# EAGLE design TestBench_rev3.6 (EAGLE 6.4)
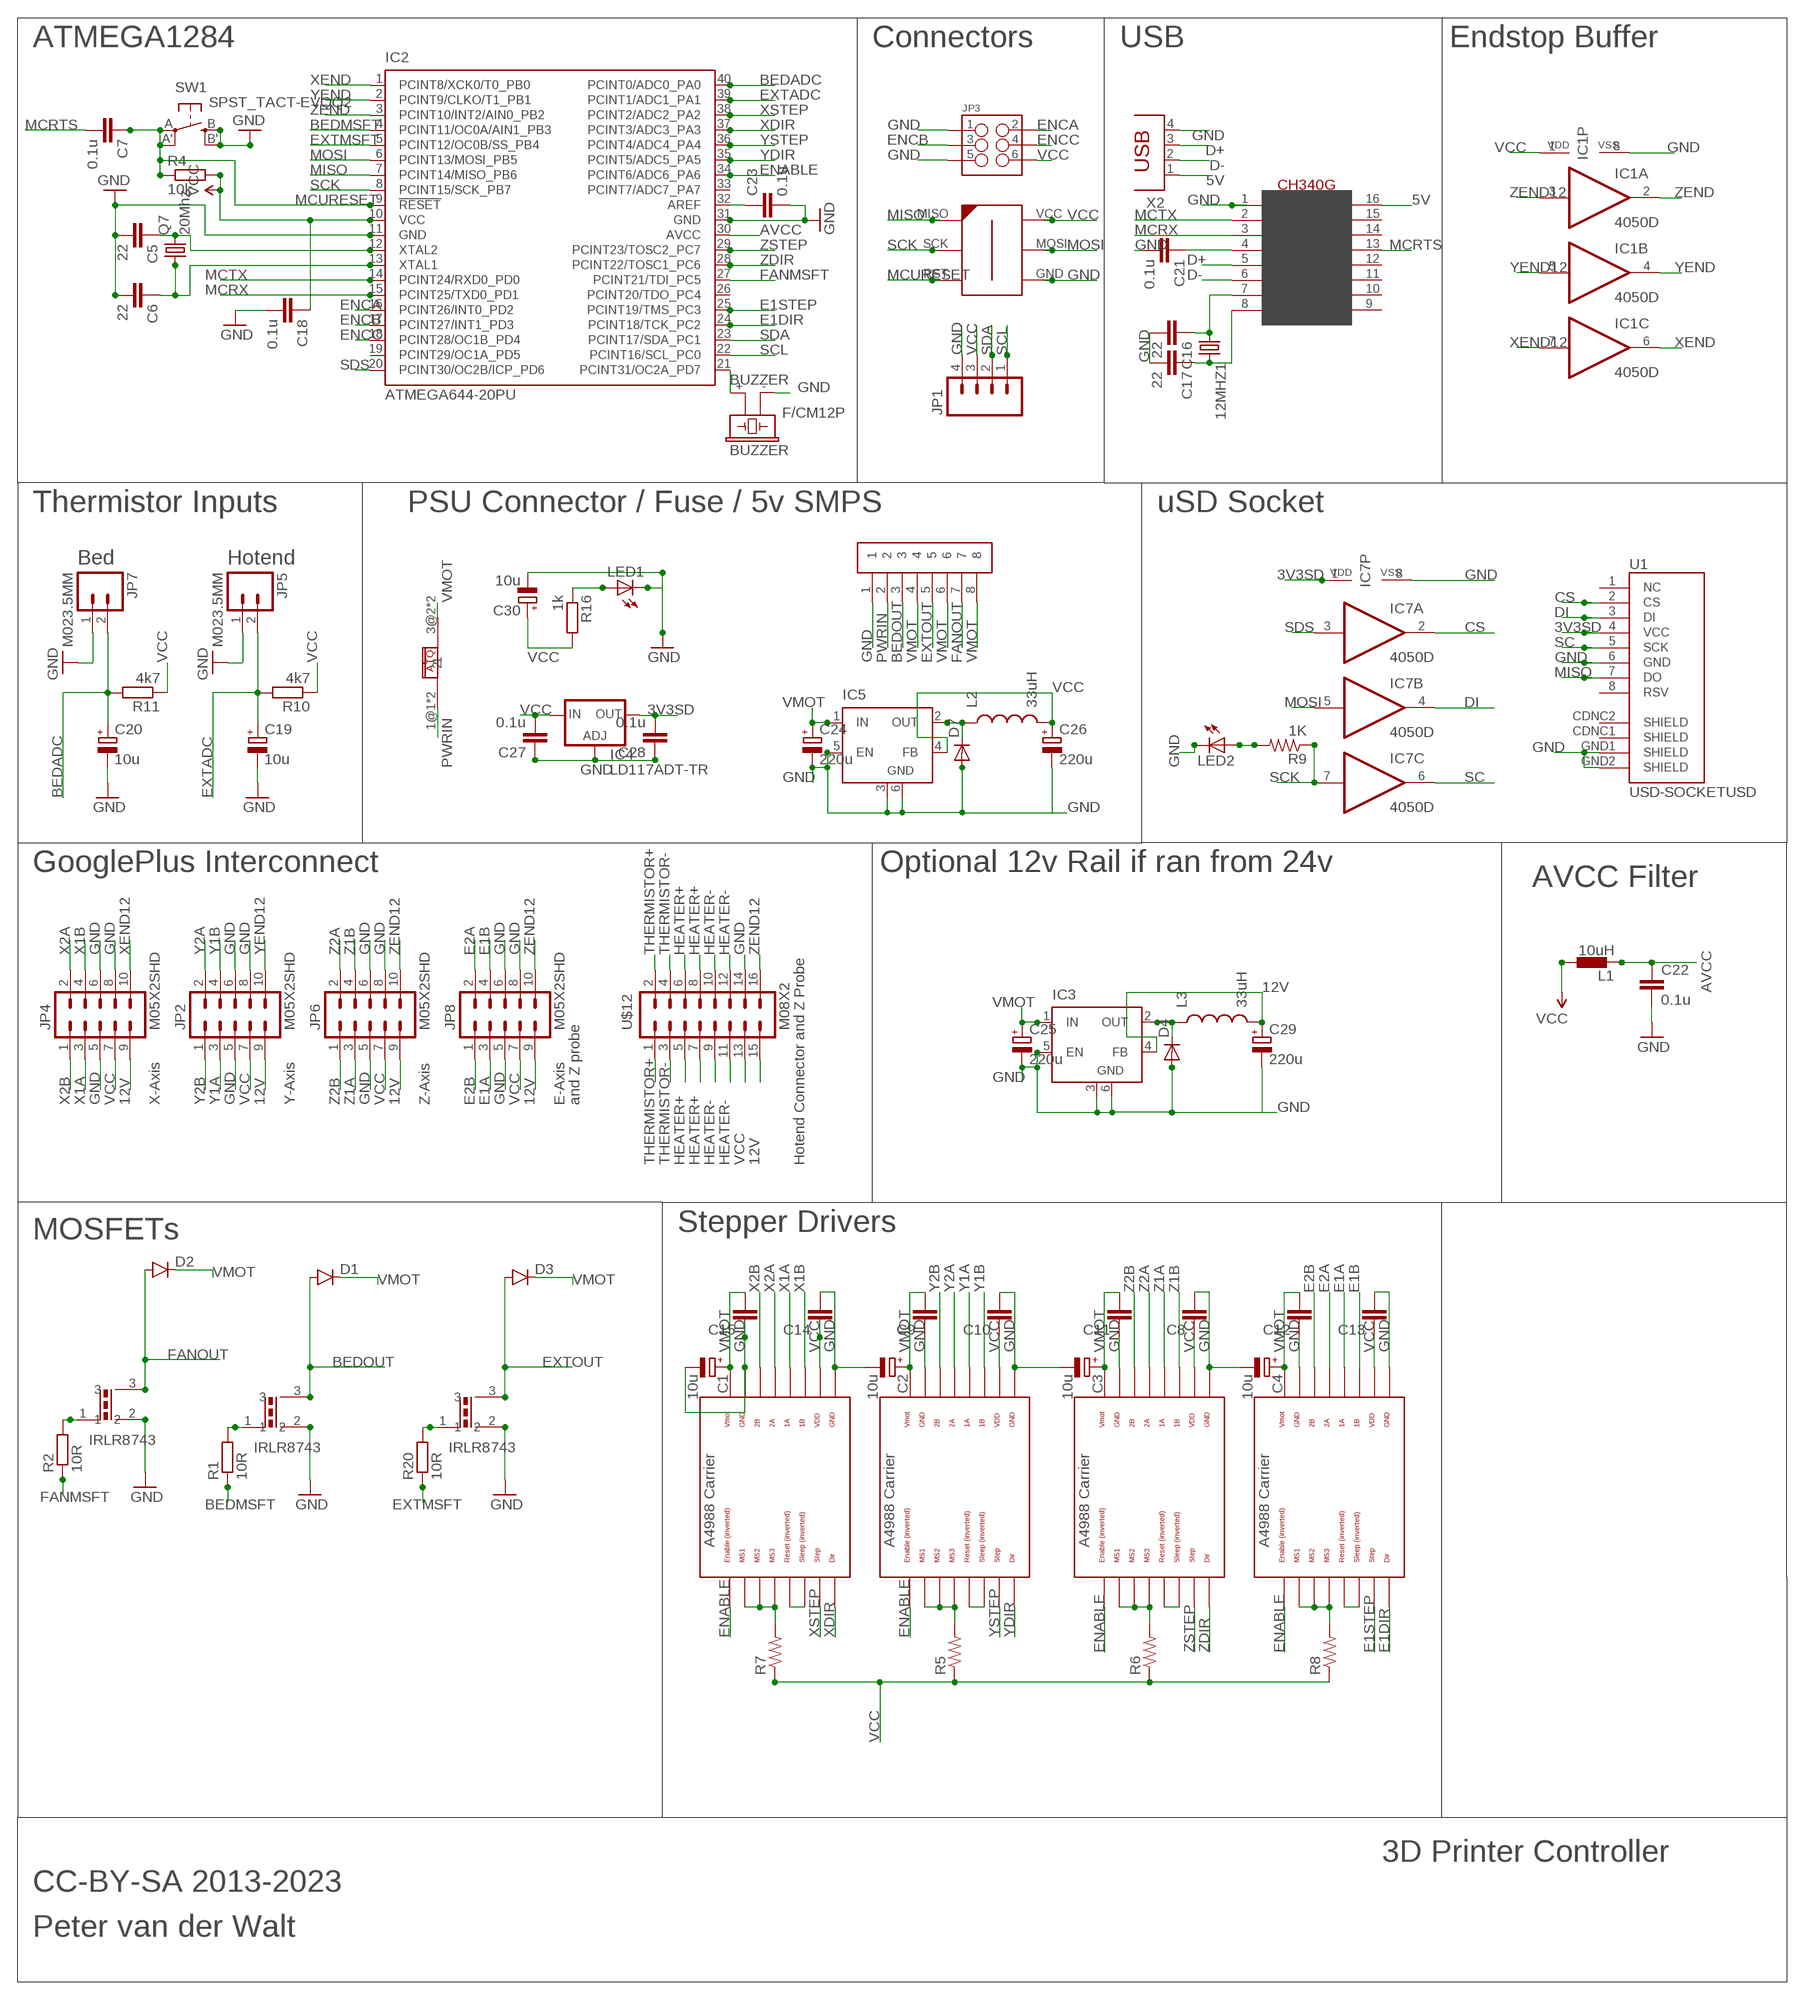
[diagram p0: schematic, sheet 1]

## Parts
12MHZ1  CRYSTALHC49UP  [HC49UP]
BUZZER  F/CM12P  [F/CM12P]
C1  10u  CPOL-EUSANYO_SMD_B6  [SANYO-OSCON_SMD_B6]
C2  10u  CPOL-EUSANYO_SMD_B6  [SANYO-OSCON_SMD_B6]
C3  10u  CPOL-EUSANYO_SMD_B6  [SANYO-OSCON_SMD_B6]
C4  10u  CPOL-EUSANYO_SMD_B6  [SANYO-OSCON_SMD_B6]
C5  22  CAP1206  [1206]
C6  22  CAP1206  [1206]
C7  0.1u  CAP1206  [1206]
C8  CAP1206  [1206]
C9  CAP1206  [1206]
C10  CAP1206  [1206]
C11  CAP1206  [1206]
C12  CAP1206  [1206]
C13  CAP1206  [1206]
C14  CAP1206  [1206]
C15  CAP1206  [1206]
C16  22  CAP1206  [1206]
C17  22  CAP1206  [1206]
C18  0.1u  CAP1206  [1206]
C19  10u  CPOL-EUSANYO_SMD_B6  [SANYO-OSCON_SMD_B6]
C20  10u  CPOL-EUSANYO_SMD_B6  [SANYO-OSCON_SMD_B6]
C21  0.1u  CAP1206  [1206]
C22  0.1u  CAP1206  [1206]
C23  0.1u  CAP1206  [1206]
C24  220u  CPOL-EU153CLV-0605  [153CLV-0605]
C25  220u  CPOL-EU153CLV-0605  [153CLV-0605]
C26  220u  CPOL-EU153CLV-0605  [153CLV-0605]
C27  0.1u  CAP1206  [1206]
C28  0.1u  CAP1206  [1206]
C29  220u  CPOL-EU153CLV-0605  [153CLV-0605]
C30  10u  CPOL-EUSANYO_SMD_B6  [SANYO-OSCON_SMD_B6]
D1  DIODESMA-ALT  [SMA-DIODE_ALT]
D2  DIODESMA-ALT  [SMA-DIODE_ALT]
D3  DIODESMA-ALT  [SMA-DIODE_ALT]
D4  DIODE-DO-214AC  [DO-214AC]
D7  DIODE-DO-214AC  [DO-214AC]
E1POL  POLOLU_A4983CARRIER  [A4988BREAKOUT]
IC1  4050D  [SO16]
IC2  ATMEGA644-20PU  [DIL40]
IC3  LM2596S  [TO263-5]
IC4  LD117ADT-TR  [DPACK]
IC5  LM2596S  [TO263-5]
IC7  4050D  [SO16]
JP1  M04LOCK  [1X04_LOCK]
JP2  M05X2SHD  [2X5-SHROUDED]
JP3  M03X2SHROUD  [2X3-SHROUDED]
JP4  M05X2SHD  [2X5-SHROUDED]
JP5  M023.5MM  [SCREWTERMINAL-3.5MM-2]
JP6  M05X2SHD  [2X5-SHROUDED]
JP7  M023.5MM  [SCREWTERMINAL-3.5MM-2]
JP8  M05X2SHD  [2X5-SHROUDED]
L1  10uH  BL01RN1A  [BL01RN1A]
L2  33uH  INDUCTORPWR  [CDRH125]
L3  33uH  INDUCTORPWR  [CDRH125]
LED1  LEDSMT1206  [1206]
LED2  LEDSMT1206  [1206]
Q7  20Mhz  CRYSTALHC49UP  [HC49UP]
R1  10R  R-EU_M1206  [M1206]
R2  10R  R-EU_M1206  [M1206]
R4  10k  R-EU_M1206  [M1206]
R5  RESISTOR1206  [1206]
R6  RESISTOR1206  [1206]
R7  RESISTOR1206  [1206]
R8  RESISTOR1206  [1206]
R9  1K  R-US_M1206  [M1206]
R10  4k7  R-EU_M1206  [M1206]
R11  4k7  R-EU_M1206  [M1206]
R16  1k  R-EU_M1206  [M1206]
R20  10R  R-EU_M1206  [M1206]
SW1  SPST_TACT-EVQQ2  [EVQ-Q2]
U1  USD-SOCKETUSD  [USD-SOCKET-PP]
U$1  IRLR8743  [TO263]
U$2  CH340G  [SOIC16]
U$3  IRLR8743  [TO263]
U$4  IRLR8743  [TO263]
U$5  XY825A-8P  [XY825A-8P]
U$6  CQ-121  [CQ121]
U$7  AVR-ISP-6-EDGE  [6PAD_ISP]
U$12  M08X2  [2X8]
X2  PN61729  [PN61729]
XPOL  POLOLU_A4983CARRIER  [A4988BREAKOUT]
YPOL  POLOLU_A4983CARRIER  [A4988BREAKOUT]
ZPOL  POLOLU_A4983CARRIER  [A4988BREAKOUT]

## Nets
3V3SD: C28.2 IC4.4(OUT) IC7.1(P:VDD) U1.4(VCC)
5V: U$2.16(VCC) X2.1
12V: C29.+ IC3.4(FB) JP2.9 JP4.9 JP6.9 JP8.9 L3.2 U$12.15
AVCC: C22.1 IC2.30(AVCC) L1.1
BEDADC: C20.+ IC2.40(PCINT0/ADC0_PA0) JP7.2 R11.2
BEDMSFT: IC2.4(PCINT11/OC0A/AIN1_PB3) R1.1
BEDOUT: D1.A U$3.3 U$5.3
BUZZER: BUZZER.+ IC2.21(PCINT31/OC2A_PD7)
CS: IC7.2(A:O) U1.2(CS)
D+: U$2.5(D+) X2.3
D-: U$2.6(D-) X2.2
DI: IC7.4(B:O) U1.3(DI)
E1A: E1POL.1A JP8.3
E1B: E1POL.1B JP8.4
E1DIR: E1POL.DIR IC2.24(PCINT18/TCK_PC2)
E1STEP: E1POL.STEP IC2.25(PCINT19/TMS_PC3)
E2A: E1POL.2A JP8.2
E2B: E1POL.2B JP8.1
ENABLE: E1POL.EN IC2.34(PCINT6/ADC6_PA6) XPOL.EN YPOL.EN ZPOL.EN
ENCA: IC2.16(PCINT26/INT0_PD2) JP3.2
ENCB: IC2.17(PCINT27/INT1_PD3) JP3.3
ENCC: IC2.18(PCINT28/OC1B_PD4) JP3.4
EXTADC: C19.+ IC2.39(PCINT1/ADC1_PA1) JP5.2 R10.2
EXTMSFT: IC2.5(PCINT12/OC0B/SS_PB4) R20.1
EXTOUT: D3.A U$1.3 U$5.5
FANMSFT: IC2.27(PCINT21/TDI_PC5) R2.1
FANOUT: D2.A U$4.3 U$5.7
GND: BUZZER.- C1.- C2.- C3.- C4.- C5.2 C6.2 C8.2 C9.1 C10.2 C11.1 C12.1 C13.2 C14.2 C15.1 C16.2 C17.2 C18.2 C19.- C20.- C21.2 C22.2 C23.2 C24.- C25.- C26.- C27.1 C28.1 C29.- C30.- D4.2(A) D7.2(A) E1POL.GND E1POL.GND@0(GND) IC1.8(P:VSS) IC2.11(GND) IC2.31(GND) IC3.3(GND) IC3.5(EN) IC3.6(GND) IC4.1(ADJ) IC5.3(GND) IC5.5(EN) IC5.6(GND) IC7.8(P:VSS) JP1.4 JP2.5 JP2.6 JP2.8 JP3.1 JP3.5 JP4.5 JP4.6 JP4.8 JP5.1 JP6.5 JP6.6 JP6.8 JP7.1 JP8.5 JP8.6 JP8.8 LED1.C LED2.C SW1.B'(S1) SW1.B(S) U1.6(GND) U1.GND1(SHIELD) U1.GND2(SHIELD) U$1.2 U$2.1(GND) U$3.2 U$4.2 U$5.1 U$7.GND U$12.14 X2.4 XPOL.GND XPOL.GND@0(GND) YPOL.GND YPOL.GND@0(GND) ZPOL.GND ZPOL.GND@0(GND)
HEATER+: U$12.5 U$12.6 U$12.7 U$12.8
HEATER-: U$12.9 U$12.10 U$12.11 U$12.12
MCRTS: C7.2 U$2.13(DTR)
MCRX: IC2.15(PCINT25/TXD0_PD1) U$2.3(RX)
MCTX: IC2.14(PCINT24/RXD0_PD0) U$2.2(TX)
MCURESET: C7.1 IC2.9(!RESET) R4.1 SW1.A'(P1) SW1.A(P) U$7.RST
MISO: IC2.7(PCINT14/MISO_PB6) U1.7(DO) U$7.MISO
MOSI: IC2.6(PCINT13/MOSI_PB5) IC7.5(B:I) U$7.MOSI
N$1: D4.1(C) IC3.2(OUT) L3.1
N$7: R1.2 U$3.1
N$8: R2.2 U$4.1
N$9: D7.1(C) IC5.2(OUT) L2.1
N$11: C5.1 IC2.12(XTAL2) Q7.2
N$12: C6.1 IC2.13(XTAL1) Q7.1
N$14: E1POL.RST E1POL.SLP(SLEEP)
N$15: ZPOL.RST ZPOL.SLP(SLEEP)
N$16: YPOL.RST YPOL.SLP(SLEEP)
N$17: XPOL.RST XPOL.SLP(SLEEP)
N$18: R7.2 XPOL.MS1 XPOL.MS2 XPOL.MS3
N$19: R5.2 YPOL.MS1 YPOL.MS2 YPOL.MS3
N$20: E1POL.MS1 E1POL.MS2 E1POL.MS3 R8.2
N$21: R6.2 ZPOL.MS1 ZPOL.MS2 ZPOL.MS3
N$38: 12MHZ1.1 C16.1 U$2.7(XI)
N$39: LED2.A R9.2
N$40: 12MHZ1.2 C17.1 U$2.8(XO)
N$41: C21.1 U$2.4(V3)
N$46: R20.2 U$1.1
N$54: C23.1 IC2.32(AREF)
N$64: LED1.A R16.1
PWRIN: U$5.2 U$6.1@1 U$6.2@1
SC: IC7.6(C:O) U1.5(SCK)
SCK: IC2.8(PCINT15/SCK_PB7) IC7.7(C:I) R9.1 U$7.SCK
SCL: IC2.22(PCINT16/SCL_PC0) JP1.1
SDA: IC2.23(PCINT17/SDA_PC1) JP1.2
SDS: IC2.20(PCINT30/OC2B/ICP_PD6) IC7.3(A:I)
THERMISTOR+: U$12.1 U$12.2
THERMISTOR-: U$12.3 U$12.4
VCC: C8.1 C10.1 C13.1 C14.1 C18.1 C26.+ C27.2 C30.+ E1POL.VDD IC1.1(P:VDD) IC2.10(VCC) IC4.3(IN) IC5.4(FB) JP1.3 JP2.7 JP3.6 JP4.7 JP6.7 JP8.7 L1.2 L2.2 R4.2 R5.1 R6.1 R7.1 R8.1 R10.1 R11.1 R16.2 U$7.VCC U$12.13 XPOL.VDD YPOL.VDD ZPOL.VDD
VMOT: C1.+ C2.+ C3.+ C4.+ C9.2 C11.2 C12.2 C15.2 C24.+ C25.+ D1.C D2.C D3.C E1POL.VMOT IC3.1(IN) IC5.1(IN) U$5.4 U$5.6 U$5.8 U$6.3@2 U$6.4@2 XPOL.VMOT YPOL.VMOT ZPOL.VMOT
X1A: JP4.3 XPOL.1A
X1B: JP4.4 XPOL.1B
X2A: JP4.2 XPOL.2A
X2B: JP4.1 XPOL.2B
XDIR: IC2.37(PCINT3/ADC3_PA3) XPOL.DIR
XEND: IC1.6(C:O) IC2.1(PCINT8/XCK0/T0_PB0)
XEND12: IC1.7(C:I) JP4.10
XSTEP: IC2.38(PCINT2/ADC2_PA2) XPOL.STEP
Y1A: JP2.3 YPOL.1A
Y1B: JP2.4 YPOL.1B
Y2A: JP2.2 YPOL.2A
Y2B: JP2.1 YPOL.2B
YDIR: IC2.35(PCINT5/ADC5_PA5) YPOL.DIR
YEND: IC1.4(B:O) IC2.2(PCINT9/CLKO/T1_PB1)
YEND12: IC1.5(B:I) JP2.10
YSTEP: IC2.36(PCINT4/ADC4_PA4) YPOL.STEP
Z1A: JP6.3 ZPOL.1A
Z1B: JP6.4 ZPOL.1B
Z2A: JP6.2 ZPOL.2A
Z2B: JP6.1 ZPOL.2B
ZDIR: IC2.28(PCINT22/TOSC1_PC6) ZPOL.DIR
ZEND: IC1.2(A:O) IC2.3(PCINT10/INT2/AIN0_PB2)
ZEND12: IC1.3(A:I) JP6.10 JP8.10 U$12.16
ZSTEP: IC2.29(PCINT23/TOSC2_PC7) ZPOL.STEP
Unconnected: IC1.9(D:I) IC1.10(D:O) IC1.11(E:I) IC1.12(E:O) IC1.14(F:I) IC1.15(F:O) IC2.19(PCINT29/OC1A_PD5) IC2.26(PCINT20/TDO_PC4) IC2.33(PCINT7/ADC7_PA7) IC7.9(D:I) IC7.10(D:O) IC7.11(E:I) IC7.12(E:O) IC7.14(F:I) IC7.15(F:O) U1.1(NC) U1.8(RSV) U1.CDNC1(SHIELD) U1.CDNC2(SHIELD) U$2.9(CTS) U$2.10(DSR) U$2.11(RI) U$2.12(DCD) U$2.14(RTS) U$2.15(RS232)

## Notes on the sheet
- ATMEGA1284 | Connectors | USB | Endstop Buffer
- Thermistor Inputs | PSU Connector / Fuse / 5v SMPS | uSD Socket
- Bed | Hotend
- GooglePlus Interconnect | Optional 12v Rail if ran from 24v
- AVCC Filter
- X-Axis | Y-Axis | Z-Axis | E-Axis | and Z probe
- Hotend Connector and Z Probe
- MOSFETs | Stepper Drivers
- 3D Printer Controller
- CC-BY-SA 2013-2023
- Peter van der Walt

## Library data of the parts
12MHZ1 = crystal:CRYSTAL: CRYSTAL; OC_FARNELL: unknown; OC_NEWARK: unknown
BUZZER = buzzer:F/CM12P: BUZZER Source: Buerklin; OC_FARNELL: unknown; OC_NEWARK: unknown
C1-C4 C19 C20 C24-C26 C29 C30 = rcl:CPOL-EU: POLARIZED CAPACITOR, European symbol
C5-C18 C21-C23 C27 C28 = SparkFun-Passives:CAP: Capacitor Standard 0603 ceramic capacitor, and 0.1" leaded capacitor.
D1-D3 = SparkFun-DiscreteSemi:DIODE: Diode These are standard reverse protection diodes and small signal diodes. SMA package can handle up to about 1A. SOD-323 can handle about 200mA. What the SOD-323 package when ordering, there are some mfgs out there that are 5-pin packages.
D4 D7 = dp_devices:DIODE: Various Diode Packages
E1POL XPOL YPOL ZPOL = RepRapjr:POLOLU_A4983CARRIER
IC1 IC7 = 40xx:4050: Hex non-inverting BUFFER
IC2 = atmel:ATMEGA644-*PU: 8-bit Microcontroller with 64K Bytes In-System Programmable Flash Auto generated by make-symbol-device-package-bsdl.ulp Rev. 34 Source: http://www.atmel.com/dyn/resources/prod_documents/doc2593.pdf; MPN: ATMEGA644-20PU; OC_FARNELL: 1288340; OC_NEWARK: 23M5060
IC3 IC5 = linear:LM2596S: STEP-DOWN VOLTAGE REGULATOR
IC4 = v-reg:LD117A?*: Low drop fixed and adjustable positive voltage regulators 1 A Source: http://www.st.com/stonline/products/literature/ds/7194/ld1117axx.pdf
JP1 = SparkFun-Connectors:M04: Header 4 Standard 4-pin 0.1" header. Use with straight break away headers (SKU : PRT-00116), right angle break away headers (PRT-00553), swiss pins (PRT-00743), machine pins (PRT-00117), and female headers (PRT-00115). Molex polarized connector foot print use with SKU : PRT-08231 with associated crimp pins and housings. 1MM SMD Version SKU: PRT-10208
JP2 JP4 JP6 JP8 = SparkFun-Connectors:M05X2: Header 5x2 Standard 10-pin dual row 0.1" header. Commonly used with AVR-ISP. Use with Spark Fun Electronics SKU: PRT-00778
JP3 = SparkFun-Connectors:M03X2: 2x3 .1" header. Shrouded, with keying- CONN-10681 SMT- CONN-11415 Pogo pins- HW-11044; PROD_ID: CONN-10681
JP5 JP7 = SparkFun-Connectors:M02: Standard 2-pin 0.1" header. Use with - straight break away headers ( PRT-00116) - right angle break away headers (PRT-00553) - swiss pins (PRT-00743) - machine pins (PRT-00117) - female headers (PRT-00115) Molex polarized connector foot print use with: PRT-08233 with associated crimp pins and housings. 2.54_SCREWTERM for use with PRT-10571. 3.5mm Screw Terminal footprints for PRT-08084 5mm Screw Terminal footprints for use with PRT-08432
L1 = inductors:BL0: Noise Suppression Products/EMI Suppression Filters, Lead EMIFIL(R) Inductor Type Source: http://www.murata.com .. BL01RN1_DS.pdf
L2 L3 = SparkFun-Passives:INDUCTOR: Inductors Basic Inductor/Choke - 0603 and 1206. Footprints are not proven and vary greatly between part numbers. SRN6045- 33uH, 20% 1.4A SDR0403-560KL - 56uH, 10%, 500mA RMS/740mA peak
LED1 LED2 = adafruit:LED: LED OSRAM: - CHIPLED LG R971, LG N971, LY N971, LG Q971, LY Q971, LO R971, LY R971 LH N974, LH R974 LS Q976, LO Q976, LY Q976 LO Q996 - Hyper CHIPLED LW Q18S LB Q993, LB Q99A, LB R99A - SideLED LS A670, LO A670, LY A670, LG A670, LP A670 LB A673, LV A673, LT A673, LW A673 LH A674 LY A675 LS A676, LA A676, LO A676, LY A676, LW A676 LS A679, LY A679, LG A679 - Hyper Micro SIDELED® LS Y876, LA Y876, LO Y876, LY Y876 LT Y87S - SmartLED LW L88C, LW L88S LB L89C, LB L89S, LG L890 LS L89K, LO L89K, LY L89K LS L896, LA L896, LO L896, LY L896 - TOPLED LS T670, LO T670, LY T670, LG T670, LP T670 LSG T670, LSP T670, LSY T670, LOP T670, LYG T670 LG T671, LOG T671, LSG T671 LB T673, LV T673, LT T673, LW T673 LH T674 LS T676, LA T676, LO T676, LY T676, LB T676, LH T676, LSB T676, LW T676 LB T67C, LV T67C, LT T67C, LS T67K, LO T67K, LY T67K, LW E67C LS E67B, LA E67B, LO E67B, LY E67B, LB E67C, LV E67C, LT E67C LW T67C LS T679, LY T679, LG T679 LS T770, LO T770, LY T770, LG T770, LP T770 LB T773, LV T773, LT T773, LW T773 LH T774 LS E675, LA E675, LY E675, LS T675 LS T776, LA T776, LO T776, LY T776, LB T776 LHGB T686 LT T68C, LB T68C - Hyper Mini TOPLED® LB M676 - Mini TOPLED Santana® LG M470 LS M47K, LO M47K, LY M47K Source: http://www.osram.convergy.de/
Q7 = adafruit:CRYSTAL: CRYSTAL; OC_FARNELL: unknown; OC_NEWARK: unknown
R1 R2 R4 R10 R11 R16 R20 = resistor:R-EU_: RESISTOR, European symbol
R5-R8 = SparkFun-Passives:RESISTOR: Resistor Basic schematic elements and footprints for 0603, 1206, and PTH resistors.
R9 = adafruit:R-US_: RESISTOR, American symbol
SW1 = adafruit:SPST_TACT: SMT 6mm switch, EVQQ2 series http://www.ladyada.net/library/eagle
U1 = SparkFun-Connectors_PETERMICROSDEBAY:USD-SOCKET: microSD Socket Push-push type uSD socket. Schematic element and footprint production proven. Spark Fun Electronics SKU : PRT-00127. tDoc lines correctly indicate media card edge positions when inserting (unlocked, locked, depressed).
U$1 U$3 U$4 = IRLR8743:IRLR8743
U$2 = usb-serial:CH340G
U$5 = Communica.co.za:XY825A-8P
U$6 = Mantech.co.za:CQ-121
U$7 = atmega-atxmega:AVR-ISP-6-EDGE: 6 pin edge connector for ISP with ATMEL MCUs. Developed by Craig Moates (craig at moates dot net). Library by David Blundell (blundar at gmail dot com). Often, even a 6 pin header is really inconvenient for board layout and/or production. This SMD-only header is our de-facto standard for using an edge connector for programming with the help of a 6pin/10pin to edge card adapter.
U$12 = SparkFun-Connectors:M08X2: .1" headers, two rows of 8 each
X2 = con-berg:PN61729: BERG USB connector; OC_FARNELL: unknown; OC_NEWARK: unknown

## Board
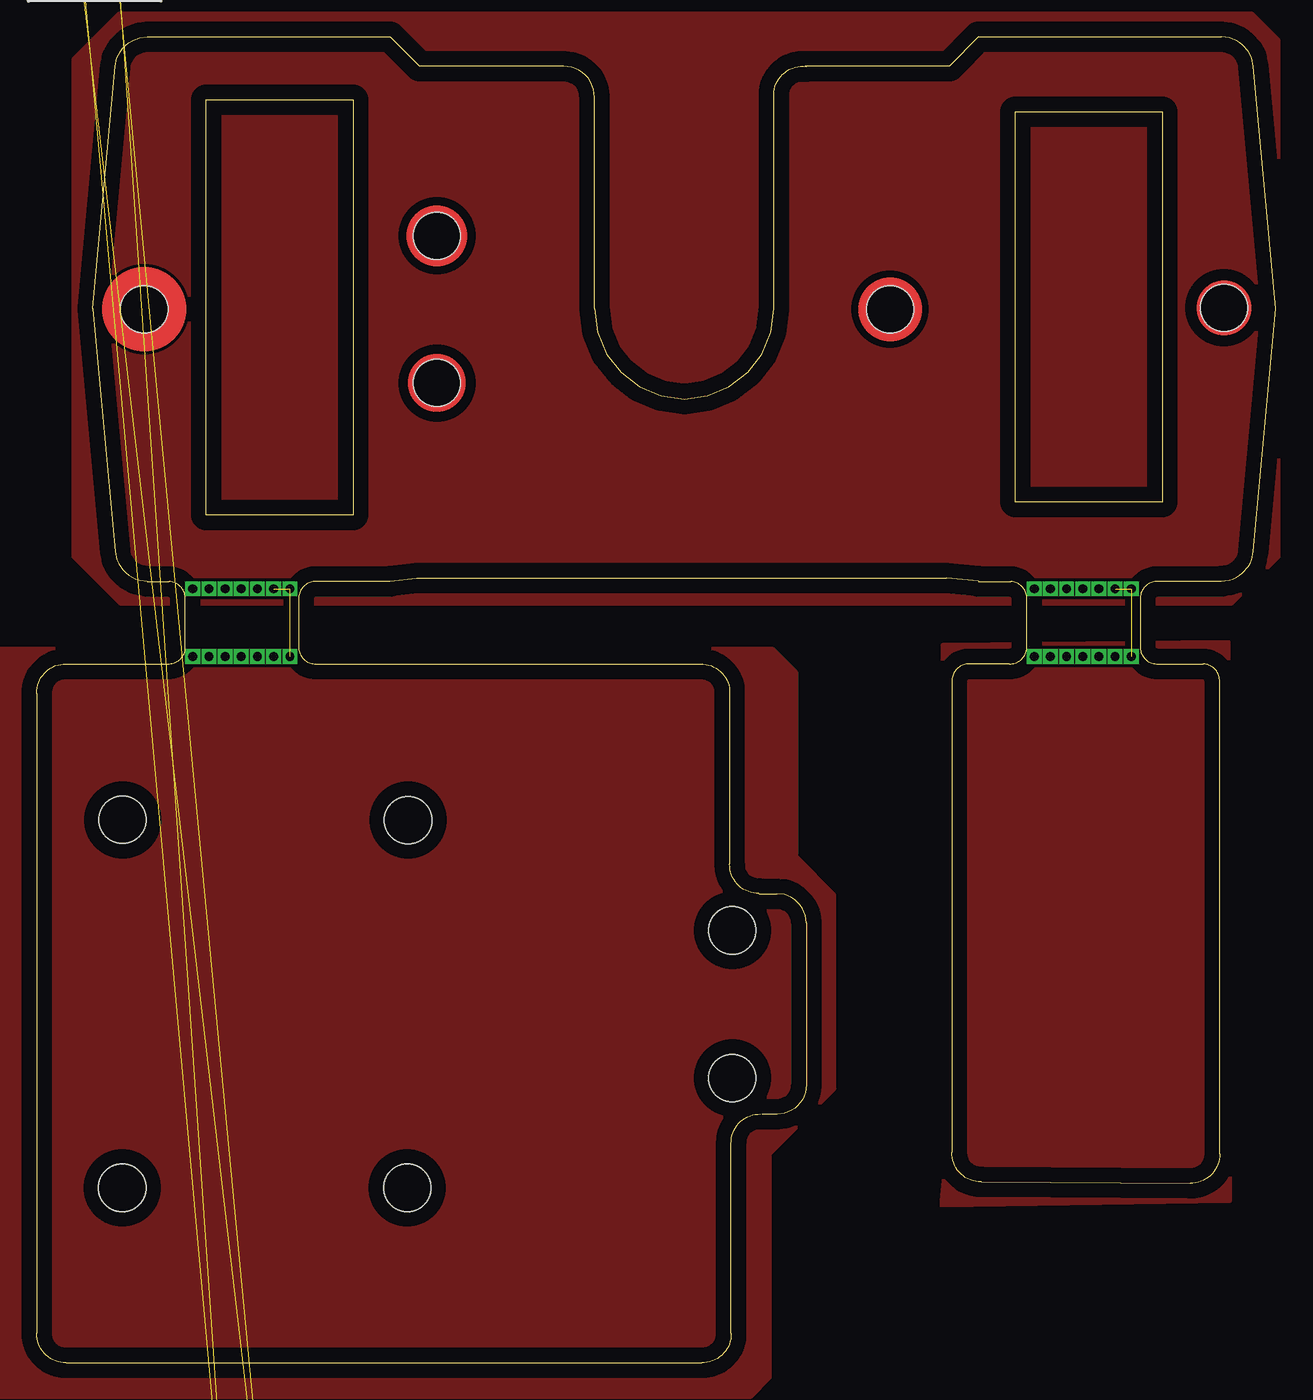
[diagram p1: board, top side]
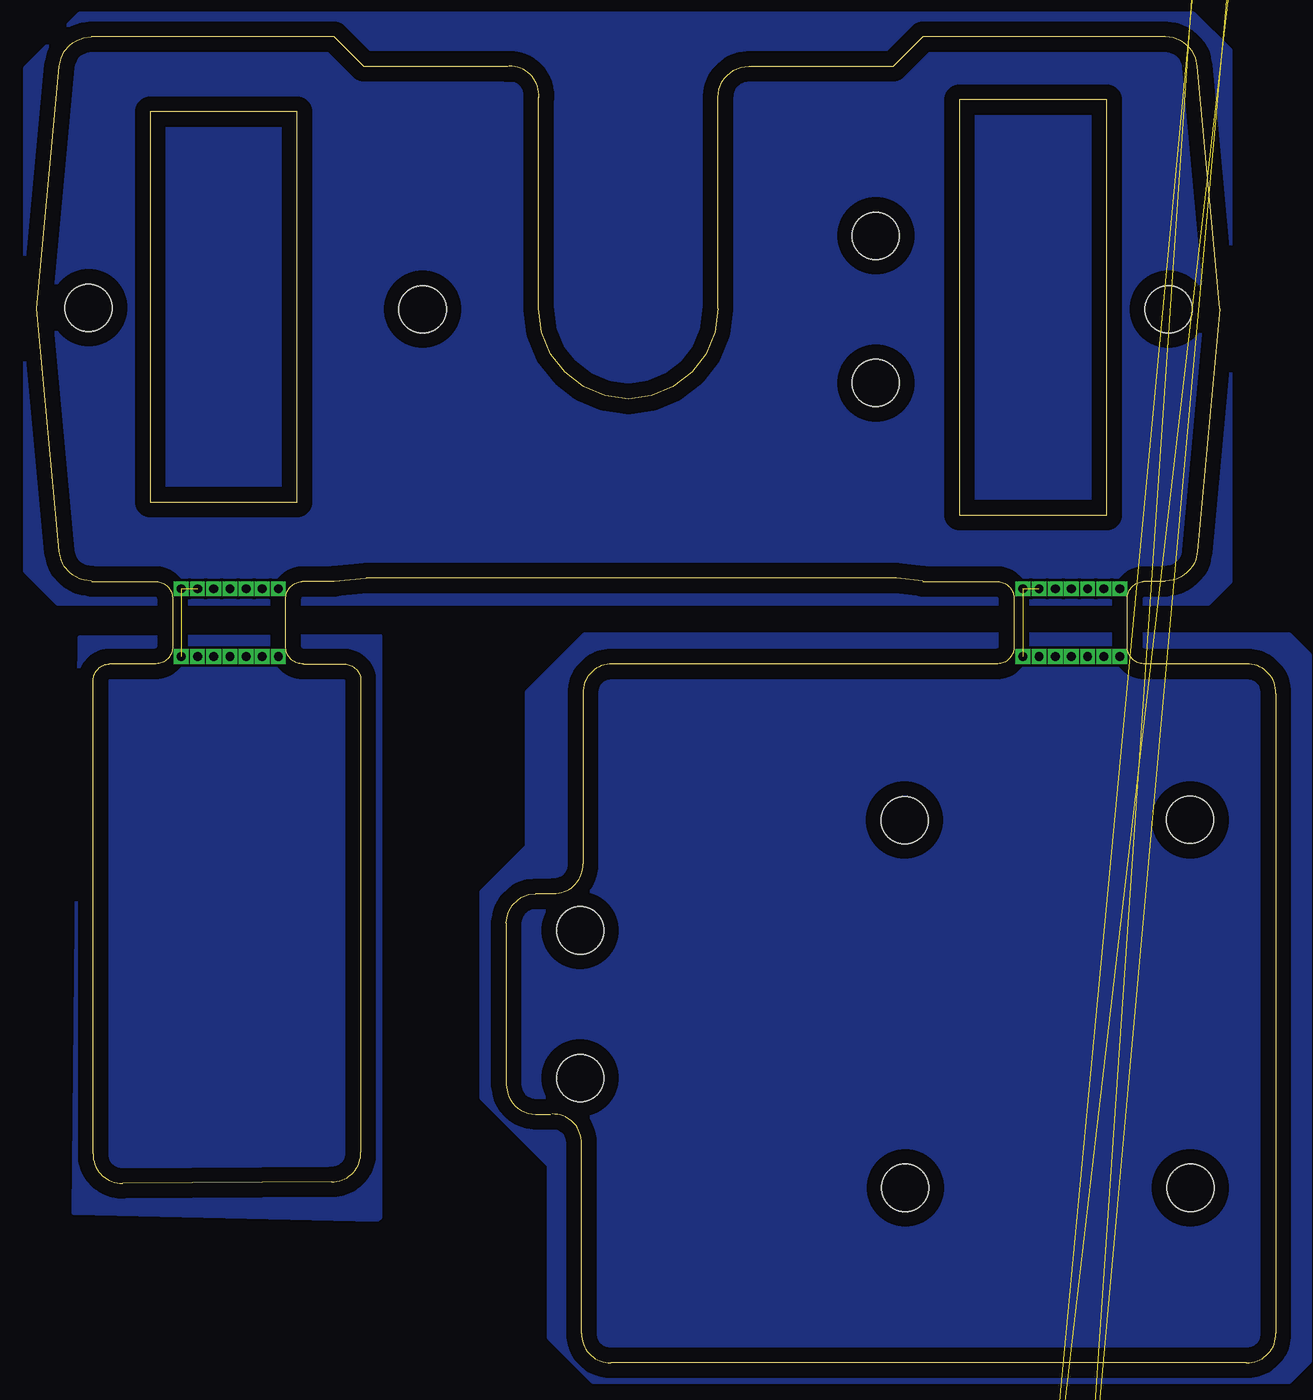
[diagram p2: board, bottom side, seen from below]

Size 84.23 x 90.13 mm. Coordinates in mm from the lower left corner, seen from the top.
Outline: 49.09,31.87 50.31,31.87 50.81,31.82 51.07,31.72 51.3,31.62 51.53,31.47 51.88,31.11 52.03,30.88 52.16,30.66 52.24,30.4 52.31,29.89 52.31,18.9 52.24,18.36 52.16,18.11 52.03,17.88 51.88,17.68 51.7,17.47 51.53,17.3 51.3,17.14 51.07,17.04 50.81,16.97 50.31,16.89 49.29,16.89
Outline: 80.52,53.12 81.05,53.19 81.3,53.27 81.56,53.4 81.79,53.52 81.99,53.7 82.35,54.11 82.47,54.34 82.57,54.59 82.7,55.12 84.23,71.63 82.7,88.12 82.57,88.65 82.47,88.91 82.35,89.13 81.99,89.54 81.79,89.72 81.56,89.85 81.3,89.97 81.05,90.05 80.52,90.13 64.01,90.13 62.03,88.12 52.22,88.12
Outline: 64.01,53.12 61.83,53.32 25.81,53.32 24,53.12
Outline: 7.52,53.12 6.98,53.19 6.73,53.27 6.48,53.4 6.25,53.52 6.05,53.7 5.84,53.91 5.69,54.11 5.56,54.34 5.44,54.59 5.33,55.12 3.81,71.63 5.33,88.12 5.44,88.65 5.56,88.91 5.69,89.13 5.84,89.34 6.05,89.54 6.25,89.72 6.48,89.85 6.73,89.97 6.98,90.05 7.52,90.13 24,90.13 26.01,88.12 35.81,88.12 36.35,88.04 36.63,87.97 36.85,87.84 37.08,87.69 37.29,87.51 37.49,87.31 37.64,87.08 37.84,86.57 37.92,86.01 37.92,71.63 38.12,70.03 38.73,68.56 39.7,67.32 40.97,66.35 42.44,65.74 44.02,65.51 45.59,65.74 47.07,66.35 48.34,67.32 49.3,68.56 49.91,70.03 50.11,71.63 50.11,86.01
Outline: 49.2,16.9 arc93 47.2,14.9 47.2,2 arc-93 45.2,0 2,0 arc-93 0,2 0,45.5 arc-93 2,47.5 8.9,47.5 arc90 10.1,48.6 10.1,51.9 arc90 9,53.1 7.5,53.1
Outline: 49.1,31.9 arc-93 47.1,33.9 47.1,45.5 arc93 45.1,47.5 18.9,47.5 arc-90 17.8,48.7 17.8,52 arc-90 19,53.1 24,53.1
Outline: 50.1,86 arc-102 52.3,88.1
Outline: 64,53.1 66.2,53.1 arc-90 67.3,51.9 67.3,48.6 arc-90 66.1,47.5 63.4,47.5 arc90 62.2,46.4 62.2,14.3 arc93 64.2,12.3 78.4,12.2 arc93 80.4,14.2 80.4,46.3 arc90 79.3,47.5 76.1,47.5 arc-90 75,48.7 75,52 arc-90 76.2,53.1 80.5,53.1
Outline: 21.51,57.61 11.51,57.61 11.51,85.83 21.51,85.83 21.51,57.61
Outline: 66.52,58.51 66.52,85.03 76.5,85.03 76.5,58.51 66.52,58.51
Copper layers (1*16): Top 0.035mm / dielectric 1.5mm / Bottom 0.035mm
Design rules "default": minimum track width 10mil, minimum drill 24mil, track to track 8mil, track to pad 8mil, pad to pad 8mil, via to via 8mil, smd to smd 8mil, copper to edge 40mil, drill to drill 8mil, minimum pad ring 10mil, minimum via ring 8mil, stop-mask expansion 4mil, vias tented up to drill 0mil, thermal gap 10mil
Holes 3.2 mm at 5.83,36.9 25.24,36.88 25.19,11.89 5.81,11.89 47.28,29.39 47.28,19.35 80.7,71.7 58,71.6 27.2,66.6 27.2,76.6 7.3,71.6

### Footprints (pad centres in the part's own frame; a part is rotated, then mirrored left to right if it is on the bottom)
HC49UP = smd 5.334 x 1.93: 1 -4.826,0; 2 4.826,0
F/CM12P = drill 1.016 pad 2.54 octagon: + 3.81,0; - -3.81,0
SANYO-OSCON_SMD_B6 = smd 3 x 1.6: + 2.2,0; - -2.2,0
1206 = smd 1.6 x 1.8: 1 -1.4,0; 2 1.4,0
153CLV-0605 = smd 3.5 x 1.6: + 2.7,0; - -2.7,0
SMA-DIODE_ALT = smd 2 x 2: A -2,0; C 2,0
DO-214AC = smd 1.27 x 2.1: 1 -1.98,0; 2 1.98,0
A4988BREAKOUT = drill 0.9 pad 1.676: 1A 8.89,1.27; 1B 11.43,1.27; 2A 6.35,1.27; 2B 3.81,1.27; DIR 16.51,-11.43; EN -1.27,-11.43; GND 16.51,1.27; GND@0 1.27,1.27; MS1 1.27,-11.43; MS2 3.81,-11.43; MS3 6.35,-11.43; RST 8.89,-11.43; SLP 11.43,-11.43; STEP 13.97,-11.43; VDD 13.97,1.27; VMOT -1.27,1.27
SO16 = smd 0.66 x 2.032: 1 -4.445,-3.073; 2 -3.175,-3.073; 3 -1.905,-3.073; 4 -0.635,-3.073; 5 0.635,-3.073; 6 1.905,-3.073; 7 3.175,-3.073; 8 4.445,-3.073; 9 4.445,3.073; 10 3.175,3.073; 11 1.905,3.073; 12 0.635,3.073; 13 -0.635,3.073; 14 -1.905,3.073; 15 -3.175,3.073; 16 -4.445,3.073
DIL40 = drill 0.813 long: 1 -24.13,-7.62; 2 -21.59,-7.62; 3 -19.05,-7.62; 4 -16.51,-7.62; 5 -13.97,-7.62; 6 -11.43,-7.62; 7 -8.89,-7.62; 8 -6.35,-7.62; 9 -3.81,-7.62; 10 -1.27,-7.62; 11 1.27,-7.62; 12 3.81,-7.62; 13 6.35,-7.62; 14 8.89,-7.62; 15 11.43,-7.62; 16 13.97,-7.62; 17 16.51,-7.62; 18 19.05,-7.62; 19 21.59,-7.62; 20 24.13,-7.62; 21 24.13,7.62; 22 21.59,7.62; 23 19.05,7.62; 24 16.51,7.62; 25 13.97,7.62; 26 11.43,7.62; 27 8.89,7.62; 28 6.35,7.62; 29 3.81,7.62; 30 1.27,7.62; 31 -1.27,7.62; 32 -3.81,7.62; 33 -6.35,7.62; 34 -8.89,7.62; 35 -11.43,7.62; 36 -13.97,7.62; 37 -16.51,7.62; 38 -19.05,7.62; 39 -21.59,7.62; 40 -24.13,7.62
TO263-5 = smd 1.067 x 2.159: 1 -3.404,-5.791; 2 -1.702,-5.791; 3 0,-5.791; 4 1.702,-5.791; 5 3.404,-5.791 | smd 10.8 x 10.41: 6 0,2.54
DPACK = smd 1.6 x 3: 1 -2.28,-4.8; 3 2.28,-4.8 | smd 5.8 x 6.2: 4 0,2.38
1X04_LOCK = drill 1.016 pad 1.88 square: 1 0,0.127 | drill 1.016 pad 1.88: 2 2.54,-0.127; 3 5.08,0.127; 4 7.62,-0.127
2X5-SHROUDED = drill 1.016 pad 1.88 octagon: 1 -1.27,5.08; 2 1.27,5.08; 3 -1.27,2.54; 4 1.27,2.54; 5 -1.27,0; 6 1.27,0; 7 -1.27,-2.54; 8 1.27,-2.54; 9 -1.27,-5.08; 10 1.27,-5.08
2X3-SHROUDED = drill 1.016 pad 1.88 octagon: 1 -1.27,2.54; 2 1.27,2.54; 3 -1.27,0; 4 1.27,0; 5 -1.27,-2.54; 6 1.27,-2.54
SCREWTERMINAL-3.5MM-2 = drill 1.2 pad 2.032 square: 1 0,0 | drill 1.2 pad 2.032: 2 3.5,0
BL01RN1A = drill 0.9 pad 1.5: 1 -5.08,0; 2 5.08,0
CDRH125 = smd 5.4 x 4: 1 0,4.9; 2 0,-4.9
1206' = smd 1.6 x 1.803: A -1.422,0; C 1.422,0
M1206 = smd 1.6 x 2: 1 -1.4,0; 2 1.4,0
EVQ-Q2 = smd 3.2 x 1.2: A -3.4,-2; A' 3.4,-2; B -3.4,2; B' 3.4,2
USD-SOCKET-PP = smd 0.75 x 1.5: 1 2.925,1.125; 2 1.825,1.125; 3 0.725,1.125; 4 -0.375,1.125; 5 -1.475,1.125; 6 -2.575,1.125; 7 -3.675,1.125; 8 -4.775,1.125; CD1 5.325,1.125; CD2 4.225,1.125 | smd 1.4 x 1: CDNC1 -4.55,-7.65 | smd 1.3 x 1: CDNC2 4.775,-7.65 | smd 1.5 x 1.35: GND1 -7.075,-7.55; GND2 7.075,-7.5 | hole 1.6: -5,-2.6; 5,-2.6
TO263 = smd 1.762 x 3.4: 1 -2.54,-6.6; 2 2.54,-6.6 | smd 9.34 x 9.6: 3 0,3.5
SOIC16 = smd 0.635 x 1.524: 1 -4.445,-2.695; 2 -3.175,-2.695; 3 -1.905,-2.695; 4 -0.635,-2.695; 5 0.635,-2.695; 6 1.905,-2.695; 7 3.175,-2.695; 8 4.445,-2.695; 9 4.445,2.695; 10 3.175,2.695; 11 1.905,2.695; 12 0.635,2.695; 13 -0.635,2.695; 14 -1.905,2.695; 15 -3.175,2.695; 16 -4.445,2.695
XY825A-8P = drill 1.3 pad 3.81 long: 1 -26.67,0; 2 -19.05,0; 3 -11.43,0; 4 -3.81,0; 5 3.81,0; 6 11.43,0; 7 19.05,0; 8 26.67,0
CQ121 = drill 2.5: 1@1 -7,0; 2@1 -2,0; 3@2 2,0; 4@2 7,0
6PAD_ISP = smd 1.524 x 3.302 bottom: GND 2.54,0; MOSI 0,0; VCC -2.54,0 | smd 1.524 x 3.302: MISO -2.54,0; RST 2.54,0; SCK 0,0
2X8 = drill 1.016 pad 1.88 octagon: 1 0,0; 2 0,2.54; 3 2.54,0; 4 2.54,2.54; 5 5.08,0; 6 5.08,2.54; 7 7.62,0; 8 7.62,2.54; 9 10.16,0; 10 10.16,2.54; 11 12.7,0; 12 12.7,2.54; 13 15.24,0; 14 15.24,2.54; 15 17.78,0; 16 17.78,2.54
PN61729 = drill 0.95 octagon: 1 1.25,4.71; 2 -1.25,4.71; 3 -1.25,2.71; 4 1.25,2.71 | hole 2.3: -6.02,0; 6.02,0

### Placement (x,y rotation side)
12MHZ1  42.98,435.73 180 top  (outside the outline)
BUZZER  146.17,350.95 180 top  (outside the outline)
C1  34.72,335.4 180 top  (outside the outline)
C2  34.72,360.16 180 top  (outside the outline)
C3  34.72,318.89 180 top  (outside the outline)
C4  34.72,302.38 180 top  (outside the outline)
C5  133.29,341.32 90 top  (outside the outline)
C6  133.29,347.99 270 top  (outside the outline)
C7  47.74,418.26 180 top  (outside the outline)
C8  46.16,340.48 0 top  (outside the outline)
C9  33.45,323.97 180 top  (outside the outline)
C10  46.16,323.97 0 top  (outside the outline)
C11  33.45,340.48 180 top  (outside the outline)
C12  33.45,365.24 180 top  (outside the outline)
C13  46.16,365.24 0 top  (outside the outline)
C14  46.16,307.46 0 top  (outside the outline)
C15  33.45,307.46 180 top  (outside the outline)
C16  54.73,435.41 180 top  (outside the outline)
C17  32.18,435.73 0 top  (outside the outline)
C18  228.72,310.95 0 top  (outside the outline)
C19  34.41,376.67 270 top  (outside the outline)
C20  291.44,228.19 90 top  (outside the outline)
C21  37.58,417.95 180 top  (outside the outline)
C22  26.93,277.5 0 top  (outside the outline)
C23  103.41,337.76 90 top  (outside the outline)
C24  298.57,189.35 180 top  (outside the outline)
C25  306.19,163.31 270 top  (outside the outline)
C26  298.57,211.57 180 top  (outside the outline)
C27  49.96,425.88 270 top  (outside the outline)
C28  48.69,390.64 0 top  (outside the outline)
C29  291.9,175.69 270 top  (outside the outline)
C30  227.66,294.29 180 top  (outside the outline)
D1  306.19,241.42 90 top  (outside the outline)
D2  306.19,271.9 90 top  (outside the outline)
D3  306.19,256.66 90 top  (outside the outline)
D4  293.49,167.76 270 top  (outside the outline)
D7  291.58,190.93 270 top  (outside the outline)
E1POL  32.18,366.51 0 top  (outside the outline)
IC1  47.5,245.76 270 top  (outside the outline)
IC2  115.05,340.16 90 top  (outside the outline)
IC3  318.57,173.15 270 top  (outside the outline)
IC4  56.63,398.26 180 top  (outside the outline)
IC5  314.44,201.41 270 top  (outside the outline)
IC7  46.16,399.21 90 top  (outside the outline)
JP1  110.92,380.16 0 top  (outside the outline)
JP2  3.93,147.75 0 top  (outside the outline)
JP3  114.73,372.54 90 top  (outside the outline)
JP4  3.93,170.3 0 top  (outside the outline)
JP5  23.61,377.31 270 top  (outside the outline)
JP6  3.93,125.21 0 top  (outside the outline)
JP7  301.28,228.51 90 top  (outside the outline)
JP8  3.93,102.67 0 top  (outside the outline)
L1  26.93,274.33 0 top  (outside the outline)
L2  299.2,200.46 180 top  (outside the outline)
L3  304.28,174.11 270 top  (outside the outline)
LED1  [1206']  310,193.79 180 top  (outside the outline)
LED2  [1206']  35.68,390.64 180 top  (outside the outline)
Q7  128.56,344.71 270 top  (outside the outline)
R1  289.04,249.04 0 top  (outside the outline)
R2  289.04,279.52 0 top  (outside the outline)
R4  228.72,315.08 180 top  (outside the outline)
R5  39.8,323.97 180 top  (outside the outline)
R6  39.8,340.48 180 top  (outside the outline)
R7  39.8,307.46 180 top  (outside the outline)
R8  39.8,365.24 180 top  (outside the outline)
R9  42.34,390.64 180 top  (outside the outline)
R10  29.64,376.67 270 top  (outside the outline)
R11  296.52,228.19 90 top  (outside the outline)
R16  319.2,193.47 0 top  (outside the outline)
R20  289.04,264.28 0 top  (outside the outline)
SW1  228.08,303.65 270 top  (outside the outline)
U1  38.53,398.9 270 top  (outside the outline)
U$1  295.39,256.66 270 top  (outside the outline)
U$2  41.71,425.57 90 top  (outside the outline)
U$3  295.39,241.42 270 top  (outside the outline)
U$4  295.39,271.9 270 top  (outside the outline)
U$5  314.76,249.04 90 top  (outside the outline)
U$6  313.49,210.3 180 top  (outside the outline)
U$7  129.97,330 90 top  (outside the outline)
U$12  -2.74,-8.77 0 top  (outside the outline)
X2  29.01,428.11 270 top  (outside the outline)
XPOL  32.18,308.73 0 top  (outside the outline)
YPOL  32.18,325.24 0 top  (outside the outline)
ZPOL  32.18,341.75 0 top  (outside the outline)

### Tracks (layer width: path | path; a pad name or v marks a point on that pad's centre or on a via)
3V3SD  (3 unrouted)
5V  (1 unrouted)
12V  (7 unrouted)
AVCC  (2 unrouted)
BEDADC  (3 unrouted)
BEDMSFT  (1 unrouted)
BEDOUT  (2 unrouted)
BUZZER  (1 unrouted)
CS  (1 unrouted)
D+  (1 unrouted)
D-  (1 unrouted)
DI  (1 unrouted)
E1A  (1 unrouted)
E1B  (1 unrouted)
E1DIR  (1 unrouted)
E1STEP  (1 unrouted)
E2A  (1 unrouted)
E2B  (1 unrouted)
ENABLE  (4 unrouted)
ENCA  (1 unrouted)
ENCB  (1 unrouted)
ENCC  (1 unrouted)
EXTADC  (3 unrouted)
EXTMSFT  (1 unrouted)
EXTOUT  (2 unrouted)
FANMSFT  (1 unrouted)
FANOUT  (2 unrouted)
GND  (82 unrouted)
GNDENC
  pour Top: 61.6,48.8 81,49 81.1,11 61.5,10.7 61.7,12.7
  pour Bottom: 81.7,10.2 81.3,49.3 60.9,49.4 60.9,9.9 61.1,9.7
GNDFAN
  pour Top: 5.7,51.6 81.2,51.6 84.4,54.8 84.4,89.9 82.6,91.7 5.6,91.7 2.5,88.6 2.5,54.8
  pour Bottom: 4.6,51.6 82.8,51.6 85,53.8 85,88 81.3,91.7 5.6,91.7 3.1,89.2 3.1,53.1
GNDFAN2
  pour Top: -4.2,48.5 50,48.5 51.6,46.9 51.6,34.4 54.2,31.8 54.2,18.6 49.8,14.2 49.8,-1 48.5,-2.3 -3.2,-2.3 -4.4,-1.1 -4.4,48.3
  pour Bottom: -0.9,-1.3 46.4,-1.3 49.4,1.7 49.4,13.4 54,18 54,32 50.9,35.1 50.9,45.6 47,49.5 -0.9,49.5 -2.3,48.1 -2.3,0.1
HEATER+  (3 unrouted)
HEATER-  (3 unrouted)
MCRTS  (1 unrouted)
MCRX  (1 unrouted)
MCTX  (1 unrouted)
MCURESET  (5 unrouted)
MISO  (2 unrouted)
MOSI  (2 unrouted)
N$1  (2 unrouted)
N$7  (1 unrouted)
N$8  (1 unrouted)
N$9  (2 unrouted)
N$11  (2 unrouted)
N$12  (2 unrouted)
N$14  (1 unrouted)
N$15  (1 unrouted)
N$16  (1 unrouted)
N$17  (1 unrouted)
N$18  (3 unrouted)
N$19  (3 unrouted)
N$20  (3 unrouted)
N$21  (3 unrouted)
N$38  (2 unrouted)
N$39  (1 unrouted)
N$40  (2 unrouted)
N$41  (1 unrouted)
N$46  (1 unrouted)
N$54  (1 unrouted)
N$64  (1 unrouted)
PWRIN  (2 unrouted)
S$1  (via drill 0.6)
  other vias: 10.6,48
S$2  (via drill 0.6)
  other vias: 11.7,48
S$3  (via drill 0.6)
  other vias: 12.8,48
S$4  (via drill 0.6)
  other vias: 13.9,48
S$5  (via drill 0.6)
  other vias: 15,48
S$6  (via drill 0.6)
  other vias: 16.1,48
S$7  (via drill 0.6)
  other vias: 10.6,52.6
S$8  (via drill 0.6)
  other vias: 11.7,52.6
S$9  (via drill 0.6)
  other vias: 12.8,52.6
S$10  (via drill 0.6)
  other vias: 13.9,52.6
S$11  (via drill 0.6)
  other vias: 15,52.6
S$12  (via drill 0.6)  (2 unrouted)
  other vias: 16.1,52.6 17.2,52.6 17.2,48
S$13  (via drill 0.6)
  other vias: 67.8,48
S$14  (via drill 0.6)
  other vias: 68.9,48
S$15  (via drill 0.6)
  other vias: 70,48
S$16  (via drill 0.6)
  other vias: 71.1,48
S$17  (via drill 0.6)
  other vias: 72.2,48
S$18  (via drill 0.6)
  other vias: 73.3,48
S$19  (via drill 0.6)
  other vias: 67.8,52.6
S$20  (via drill 0.6)
  other vias: 68.9,52.6
S$21  (via drill 0.6)
  other vias: 70,52.6
S$22  (via drill 0.6)
  other vias: 71.1,52.6
S$23  (via drill 0.6)
  other vias: 72.2,52.6
S$24  (via drill 0.6)  (2 unrouted)
  other vias: 73.3,52.6 74.4,52.6 74.4,48
SC  (1 unrouted)
SCK  (3 unrouted)
SCL  (1 unrouted)
SDA  (1 unrouted)
SDS  (1 unrouted)
THERMISTOR+  (1 unrouted)
THERMISTOR-  (1 unrouted)
VCC  (33 unrouted)
VMOT  (23 unrouted)
X1A  (1 unrouted)
X1B  (1 unrouted)
X2A  (1 unrouted)
X2B  (1 unrouted)
XDIR  (1 unrouted)
XEND  (1 unrouted)
XEND12  (1 unrouted)
XSTEP  (1 unrouted)
Y1A  (1 unrouted)
Y1B  (1 unrouted)
Y2A  (1 unrouted)
Y2B  (1 unrouted)
YDIR  (1 unrouted)
YEND  (1 unrouted)
YEND12  (1 unrouted)
YSTEP  (1 unrouted)
Z1A  (1 unrouted)
Z1B  (1 unrouted)
Z2A  (1 unrouted)
Z2B  (1 unrouted)
ZDIR  (1 unrouted)
ZEND  (1 unrouted)
ZEND12  (3 unrouted)
ZSTEP  (1 unrouted)
(copper drawn outside any net)
  shapes: Top circle x17

### Text on the board
OHSILK: + | - | + | OPENHARDWARE.CO.ZA | + | LED | HOTEND | THERM | OPENHARDWARE.CO.ZA | + | - | FAN | Y-END | Y-CARRIAGE | X-END | X-CARRIAGE | OPENHARDWARE.CO.ZA | OPENHARDWARE.CO.ZA